# EAGLE design adafruit-fona-800-gsm-breakoutnew (EAGLE 9.1.0)
COMPANY: ADAFRUIT INDUSTRIES; DRAWN: KTOWN; REV: C
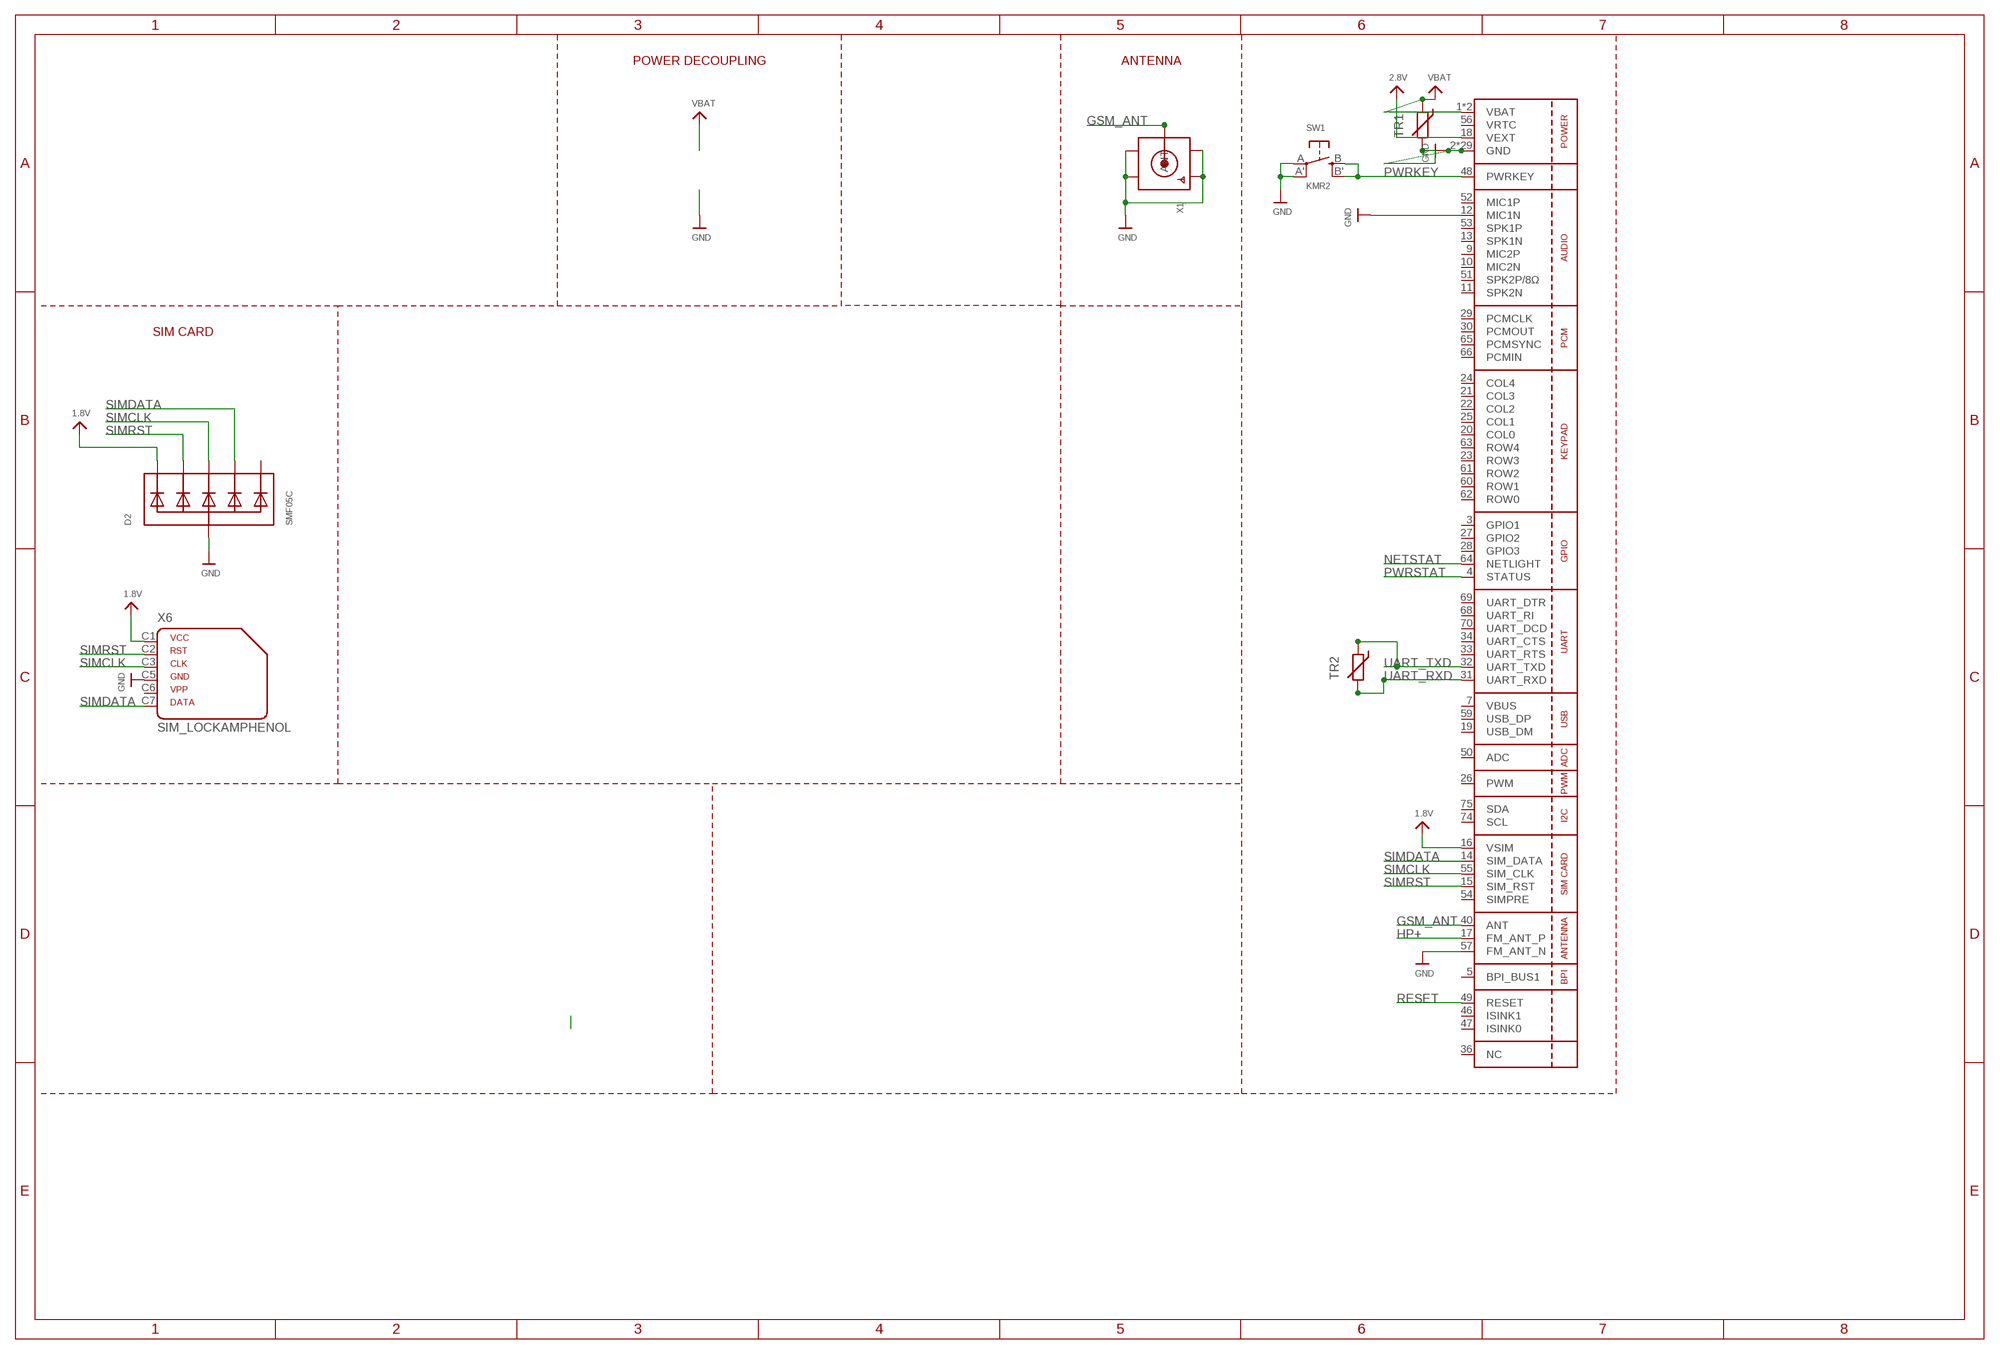
[diagram p0: schematic, sheet 1]

## Parts
D2  SMF05C  TVSARRAY_5LANE  [SOT363]
SW1  KMR2  SWITCH_TACT_SMT4.6X2.8  [BTN_KMR2_4.6X2.8]
TR1  THERMISTOR_R-5  [R-5]
TR2  THERMISTOR_R-5  [R-5]
U1  ss  GSM_SIM800L  [SIM800L]
X1  SMACONNECTOR_EDGE_UFL  [SMA_EDGELAUNCH_UFL]
X6  SIM_LOCKAMPHENOL  [C707_10M006_512_2]

## Nets
1.8V: D2.1(C1) U1.16(VSIM) X6.C1
2.8V: U1.18(VEXT)
GND: D2.2(A) SW1.A'(P1) SW1.A(P) TR1.2 U1.2(GND) U1.6(GND) U1.8(GND) U1.12(MIC1N) U1.35(GND) U1.37(GND) U1.38(GND) U1.39(GND) U1.41(GND) U1.43(GND) U1.44(GND) U1.45(GND) U1.57(FM_ANT_N) U1.58(GND) U1.67(GND) U1.71(GND) U1.72(GND) U1.73(GND) U1.76(GND) U1.77(GND) U1.78(GND) U1.79(GND) U1.80(GND) U1.81(GND) U1.82(GND) U1.83(GND) U1.84(GND) U1.85(GND) U1.86(GND) U1.87(GND) U1.88(GND) X1.GND@1(GND1) X1.GND@2(GND2) X1.GND@3(GND3) X1.GND@4(GND4) X6.C5
GSM_ANT: U1.40(ANT) X1.P(ANT)
HP+: U1.17(FM_ANT_P)
NETSTAT: U1.64(NETLIGHT)
PWRKEY: SW1.B'(S1) SW1.B(S) U1.48(PWRKEY)
PWRSTAT: U1.4(STATUS)
RESET: U1.49(RESET)
SIMCLK: D2.4(C3) U1.55(SIM_CLK) X6.C3
SIMDATA: D2.5(C4) U1.14(SIM_DATA) X6.C7
SIMRST: D2.3(C2) U1.15(SIM_RST) X6.C2
UART_RXD: TR2.2 U1.31(UART_RXD)
UART_TXD: TR2.1 U1.32(UART_TXD)
VBAT: TR1.1 U1.1(VBAT) U1.42(VBAT)
Unconnected: D2.6(C5) U1.3(GPIO1) U1.5(BPI_BUS1) U1.9(MIC2P) U1.10(MIC2N) U1.11(SPK2N) U1.13(SPK1N) U1.19(USB_DM) U1.20(COL0) U1.21(COL3) U1.22(COL2) U1.23(ROW3) U1.24(COL4) U1.25(COL1) U1.26(PWM) U1.27(GPIO2) U1.28(GPIO3) U1.29(PCMCLK) U1.30(PCMOUT) U1.33(UART_RTS) U1.34(UART_CTS) U1.36(NC) U1.46(ISINK1) U1.47(ISINK0) U1.50(ADC) U1.51(SPK2P/8Ω) U1.52(MIC1P) U1.53(SPK1P) U1.54(SIMPRE) U1.59(USB_DP) U1.60(ROW1) U1.61(ROW2) U1.62(ROW0) U1.63(ROW4) U1.65(PCMSYNC) U1.66(PCMIN) U1.68(UART_RI) U1.69(UART_DTR) U1.70(UART_DCD) U1.74(SCL) U1.75(SDA) X6.C6

## Notes on the sheet
- POWER DECOUPLING | ANTENNA
- SIM CARD

## Power pins joined to a net without a drawn wire
VBUS: U1.7(VBUS)
VRTC: U1.56(VRTC)

## Library data of the parts
D2 = microbuilder:TVSARRAY_5LANE: Voltage Transient Suppressor Array SOT363 SMF05C - 100W 5V: Digikey - SMF05CT1GOSCT-ND
SW1 = microbuilder:SWITCH_TACT_SMT: SMT Tact Switches 6x6mm - Digikey: P12940SCT-ND KMR2 (4.6x2.8mm) - Digikey: 401-1426-1-ND EVQ-PQHB55 - Light Touch, 160GF (4.5x4.5mm) - Digikey: P8090SCT-ND KMT0 - KMT021 NGJ LHS (etc.) IP68/Waterproof - Digikey: CKN10289CT-ND
TR1 TR2 = discrete:THERMISTOR_: Thermo Resistor
U1 = microbuilder:GSM_SIM800L: SIM800K Quad-Band GSM/GPRS Module 850/900/1800/1900 MHz Bluetooth EDR (3.0) FM Band: 76-109MHz (50kHz steps) -40 - 85°C
X1 = microbuilder:SMACONNECTOR: SMA Connector 90° DIP SMA Connector, 50 Ohm (4UConnector: 07259)
X6 = microbuilder:SIM_LOCK: C707A SIMLOCK® 2.5 mm with wide solder tails Source: Data sheet <http://www.amphenol.info/downloads/C707_10M006_512_2.pdf>; OC_FARNELL: unknown; OC_NEWARK: unknown

## Board
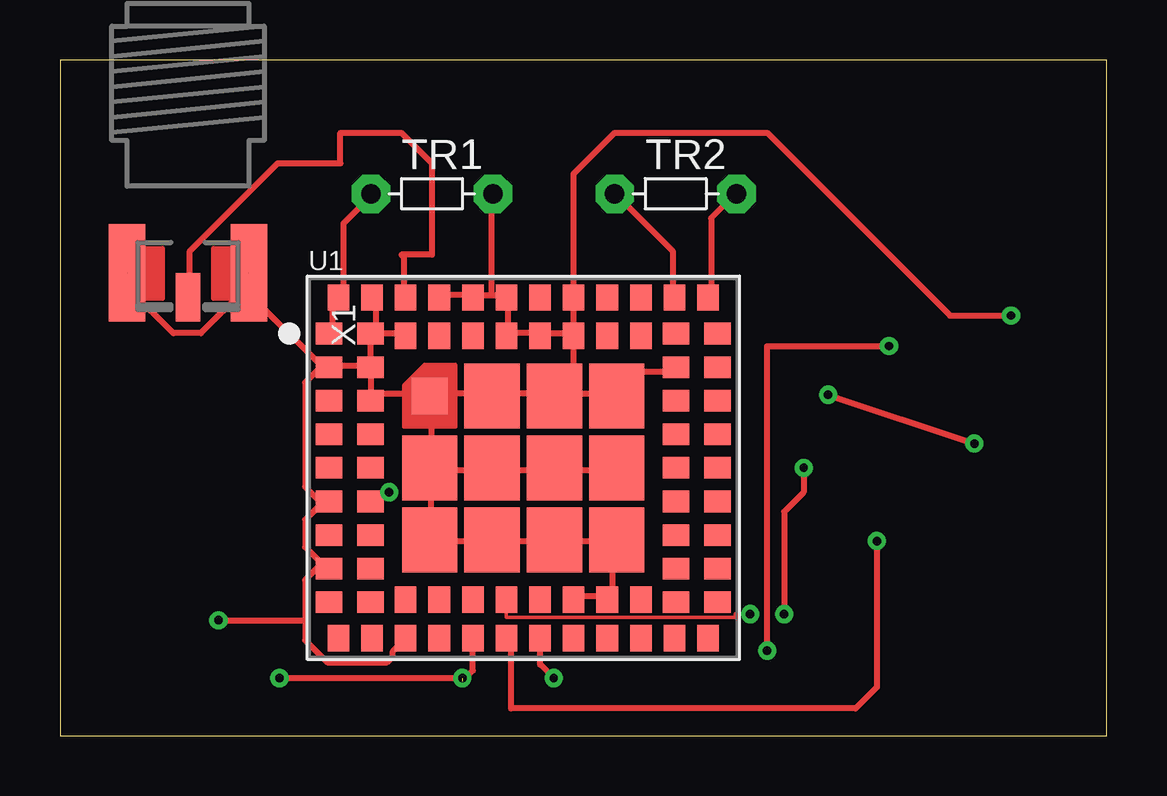
[diagram p1: board, top side]
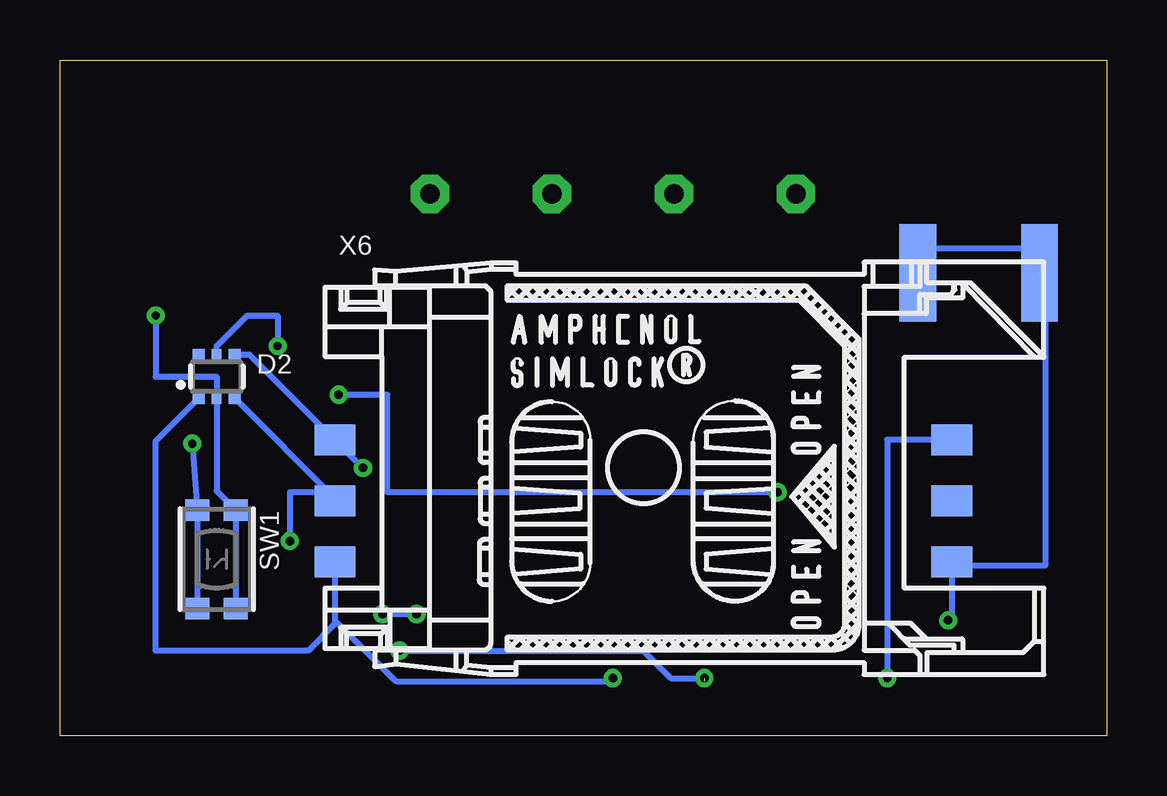
[diagram p2: board, bottom side, seen from below]

Size 43.61 x 28.18 mm. Coordinates in mm from the lower left corner, seen from the top.
Outline: 0,0 43.61,0 43.61,28.18 0,28.18 0,0
Copper layers (1*16): Top 0.035mm / dielectric 1.5mm / Bottom 0.035mm
Design rules "default *": minimum track width 10mil, minimum drill 0.35mm, track to track 4mil, track to pad 4mil, pad to pad 4mil, via to via 4mil, smd to smd 4mil, copper to edge 40mil, drill to drill 6mil, minimum pad ring 10mil, minimum via ring 8mil, stop-mask expansion 4mil, vias tented up to drill 0mil, thermal gap 10mil

### Footprints (pad centres in the part's own frame; a part is rotated, then mirrored left to right if it is on the bottom)
SOT363 = smd 0.5 x 0.5: 1 -0.75,-0.9; 3 0.75,-0.9; 4 0.75,0.9; 6 -0.75,0.9 | smd 0.4 x 0.5: 2 0,-0.9; 5 0,0.9
BTN_KMR2_4.6X2.8 = smd 0.9 x 1: A 2.05,0.8; A' -2.05,0.8; B 2.05,-0.8; B' -2.05,-0.8
R-5 = drill 0.813 pad 1.6 octagon: 1 -2.54,0; 2 2.54,0
SIM800L = smd 1.1 x 0.9: 1 -8.1,5.6; 2 -8.1,4.2; 3 -8.1,2.8; 4 -8.1,1.4; 5 -8.1,0; 6 -8.1,-1.4; 7 -8.1,-2.8; 8 -8.1,-4.2; 9 -8.1,-5.6; 22 8.1,-5.6; 23 8.1,-4.2; 24 8.1,-2.8; 25 8.1,-1.4; 26 8.1,0; 27 8.1,1.4; 28 8.1,2.8; 29 8.1,4.2; 30 8.1,5.6; 43 -6.36,5.6; 44 -6.36,4.2; 45 -6.36,2.8; 46 -6.36,1.4; 47 -6.36,0; 48 -6.36,-1.4; 49 -6.36,-2.8; 50 -6.36,-4.2; 51 -6.36,-5.6; 60 6.36,-5.6; 61 6.36,-4.2; 62 6.36,-2.8; 63 6.36,-1.4; 64 6.36,0; 65 6.36,1.4; 66 6.36,2.8; 67 6.36,4.2; 68 6.36,5.6 | smd 0.9 x 1.1: 10 -7.7,-7.1; 11 -6.3,-7.1; 12 -4.9,-7.1; 13 -3.5,-7.1; 14 -2.1,-7.1; 15 -0.7,-7.1; 16 0.7,-7.1; 17 2.1,-7.1; 18 3.5,-7.1; 19 4.9,-7.1; 20 6.3,-7.1; 21 7.7,-7.1; 31 7.7,7.1; 32 6.3,7.1; 33 4.9,7.1; 34 3.5,7.1; 35 2.1,7.1; 36 0.7,7.1; 37 -0.7,7.1; 38 -2.1,7.1; 39 -3.5,7.1; 40 -4.9,7.1; 41 -6.3,7.1; 42 -7.7,7.1; 52 -4.9,-5.5; 53 -3.5,-5.5; 54 -2.1,-5.5; 55 -0.7,-5.5; 56 0.7,-5.5; 57 2.1,-5.5; 58 3.5,-5.5; 59 4.9,-5.5; 69 4.9,5.5; 70 3.5,5.5; 71 2.1,5.5; 72 0.7,5.5; 73 -0.7,5.5; 74 -2.1,5.5; 75 -3.5,5.5; 76 -4.9,5.5 | smd 1.5 x 1.5: 77 -3.9,3 | smd 2.3 x 2.7: 78 -3.9,0; 79 -3.9,-3; 80 -1.3,-3; 81 1.3,-3; 82 3.9,-3; 83 3.9,0; 84 3.9,3; 85 1.3,3; 86 -1.3,3; 87 -1.3,0; 88 1.3,0
SMA_EDGELAUNCH_UFL = smd 4.064 x 1.524: GND@1 2.032,-2.54; GND@2 2.032,2.54 | smd 4.064 x 1.524 bottom: GND@3 2.032,2.54; GND@4 2.032,-2.54 | smd 2.032 x 1.016: P 3.048,0
C707_10M006_512_2 = smd 1.7 x 1.3: C1 -12.85,-3.915; C2 -12.85,-1.375; C3 -12.85,1.165; C5 12.85,-3.915; C6 12.85,-1.375; C7 12.85,1.165

### Placement (x,y rotation side)
D2  37.08,14.99 0 bottom
SW1  37.08,7.37 270 bottom
TR1  15.49,22.61 0 top
TR2  25.65,22.61 0 top
U1  19.3,11.18 0 top
X1  5.33,21.34 270 top
X6  19.3,11.18 0 bottom

### Tracks (layer width: path | path; a pad name or v marks a point on that pad's centre or on a via)
1.8V  (via drill 0.35)
  Top 0.254: v20.57,2.41 20,2.98 U1.16
  Bottom 0.254: X6.C1 32.15,4.83 | 32.15,4.83 32.15,4.68 33.27,3.56 39.62,3.56 39.62,12.3 D2.1 | 32.15,4.83 29.61,2.29 20.57,2.29 v20.57,2.41
GND  (via drill 0.35)  (2 unrouted)
  Top 0.254: 15.47,11.07 17.98,11.07 U1.87 18.21,11.07 20.5,11.07 U1.88 20.73,11.07 23.01,11.07 U1.83 | U1.57 21.41,5.82 22.78,5.82 U1.58 23.01,5.82 23.01,8.1 | 23.01,8.1 20.73,8.1 U1.81 20.5,8.1 18.21,8.1 U1.80 17.98,8.1 15.47,8.1 U1.79 15.47,8.33 15.47,11.07 | 23.01,8.1 U1.82 | 15.47,11.07 U1.78 15.47,11.3 15.47,14.05 U1.77 | U1.39 15.93,18.39 17.07,18.39 U1.38 17.3,18.39 17.98,18.39 | 17.98,18.39 18.44,18.39 U1.37 18.67,18.16 18.67,16.79 | 18.67,16.79 19.81,16.79 U1.72 20.04,16.79 21.18,16.79 U1.71 | U1.71 21.41,16.79 21.41,18.16 U1.35 21.4,23.44 23.11,25.15 29.46,25.15 37.08,17.53 v39.62,17.53 | 18.67,16.79 U1.73 | 17.98,18.39 17.98,22.5 TR1.2 | 10.9,7.19 11.12,7.19 U1.8 10.9,7.19 | 10.9,7.19 10.21,7.87 10.21,9.02 10.9,9.7 | 10.9,9.7 11.12,9.93 U1.6 10.9,9.7 | 10.21,4.83 10.21,6.5 10.9,7.19 | 10.21,4.83 10.21,3.99 11.12,3.07 13.64,3.07 13.87,3.3 13.87,3.53 14.33,3.99 U1.12 | 7.7,18.62 5.87,16.79 4.72,16.79 2.9,18.62 2.9,19.3 X1.GND@1 | 7.7,18.62 7.7,19.3 X1.GND@2 7.7,18.62 | 12.95,14.28 12.95,15.19 U1.44 | 12.95,14.28 12.95,14.05 U1.45 12.95,14.28 | U1.2 11.35,15.42 12.73,15.42 U1.44 | U1.43 12.95,16.56 12.95,15.42 U1.44 | 13.18,16.79 12.95,16.79 U1.43 | 13.18,16.79 14.33,16.79 U1.76 | 13.18,16.79 13.18,18.16 U1.41 | 13.18,16.79 U1.43 | 12.95,14.28 15.24,14.28 U1.77 | U1.67 25.53,15.19 24.16,15.19 23.24,14.28 U1.84 23.01,14.28 21.41,14.28 | U1.85 20.5,14.28 18.21,14.28 U1.86 17.98,14.28 15.47,14.28 U1.77 | 21.41,14.28 20.73,14.28 U1.85 | 10.9,15.42 11.12,15.19 U1.2 | 10.9,15.42 7.7,18.62 | 10.9,9.7 10.21,10.39 10.21,14.73 10.9,15.42 | 10.9,15.42 U1.2 | 21.41,14.28 21.41,16.56 U1.71 | 21.41,14.28 U1.85
  Top 0.254: v6.6,4.83 10.21,4.83
  Bottom 0.254: v6.6,4.83 6.45,4.98 X6.C5 6.45,7.11 2.54,7.11 2.54,20.32 7.62,20.32 | v39.62,17.53 39.62,14.99 37.08,14.99 D2.2 37.08,10.22 SW1.A' SW1.A
GSM_ANT
  Top 0.254: U1.40 14.33,18.39 14.33,19.96 14.22,20.07 15.49,20.07 15.49,23.88 14.22,25.15 11.68,25.15 11.68,23.88 9.07,23.88 5.41,20.22 5.41,18.39 X1.P
PWRKEY  (via drill 0.35)
  Top 0.152: U1.48 12.94,10.16 v13.72,10.16
  Top 0.254: v32,14.22 v38.1,12.19
  Bottom 0.254: SW1.B SW1.B' v38.1,12.19 | v13.72,10.16 29.97,10.16 29.97,14.22 v32,14.22
SIMCLK  (via drill 0.35)
  Top 0.152: v28.76,5.08 28.13,5.08 28.13,4.95 18.6,4.95 U1.55
  Top 0.254: v30.99,11.18 30.99,10.16 30.17,9.34 v30.17,5.08
  Bottom 0.254: D2.4 35.7,15.89 X6.C3 v30.99,11.18 | v30.17,5.08 v28.76,5.08
SIMDATA  (via drill 0.35)  (1 unrouted)
  Top 0.254: v9.14,2.41 9.14,2.29 9.27,2.41 v16.76,2.41 | 16.76,2.29 17.2,2.73 U1.14 | v29.46,3.56 29.46,16.26 v34.54,16.26
  Bottom 0.254: X6.C7 9.14,12.34 v9.14,2.41 9.14,2.29 | D2.5 37.08,16.26 35.81,17.53 34.54,17.53 v34.54,16.26 | v29.46,3.56 19.3,3.56 18.16,2.41 v16.76,2.41
SIMRST  (via drill 0.35)
  Top 0.254: v34.04,8.13 34.04,2.03 33.15,1.14 18.8,1.14 18.8,3.88 U1.15
  Bottom 0.254: D2.3 32.15,9.91 X6.C2 32.51,10.16 34.04,10.16 v34.04,8.13
UART_RXD
  Top 0.254: U1.31 27.13,18.39 27.13,21.59 28.04,22.5 TR2.2
UART_TXD
  Top 0.254: U1.32 25.53,18.39 25.53,20.22 23.24,22.5 TR2.1
VBAT
  Top 0.254: U1.1 11.35,16.79 11.35,17.93 11.58,18.16 U1.42 11.81,18.39 11.81,21.36 12.95,22.5 TR1.1